# EAGLE schematic XBee3 (EAGLE 7.4.0)
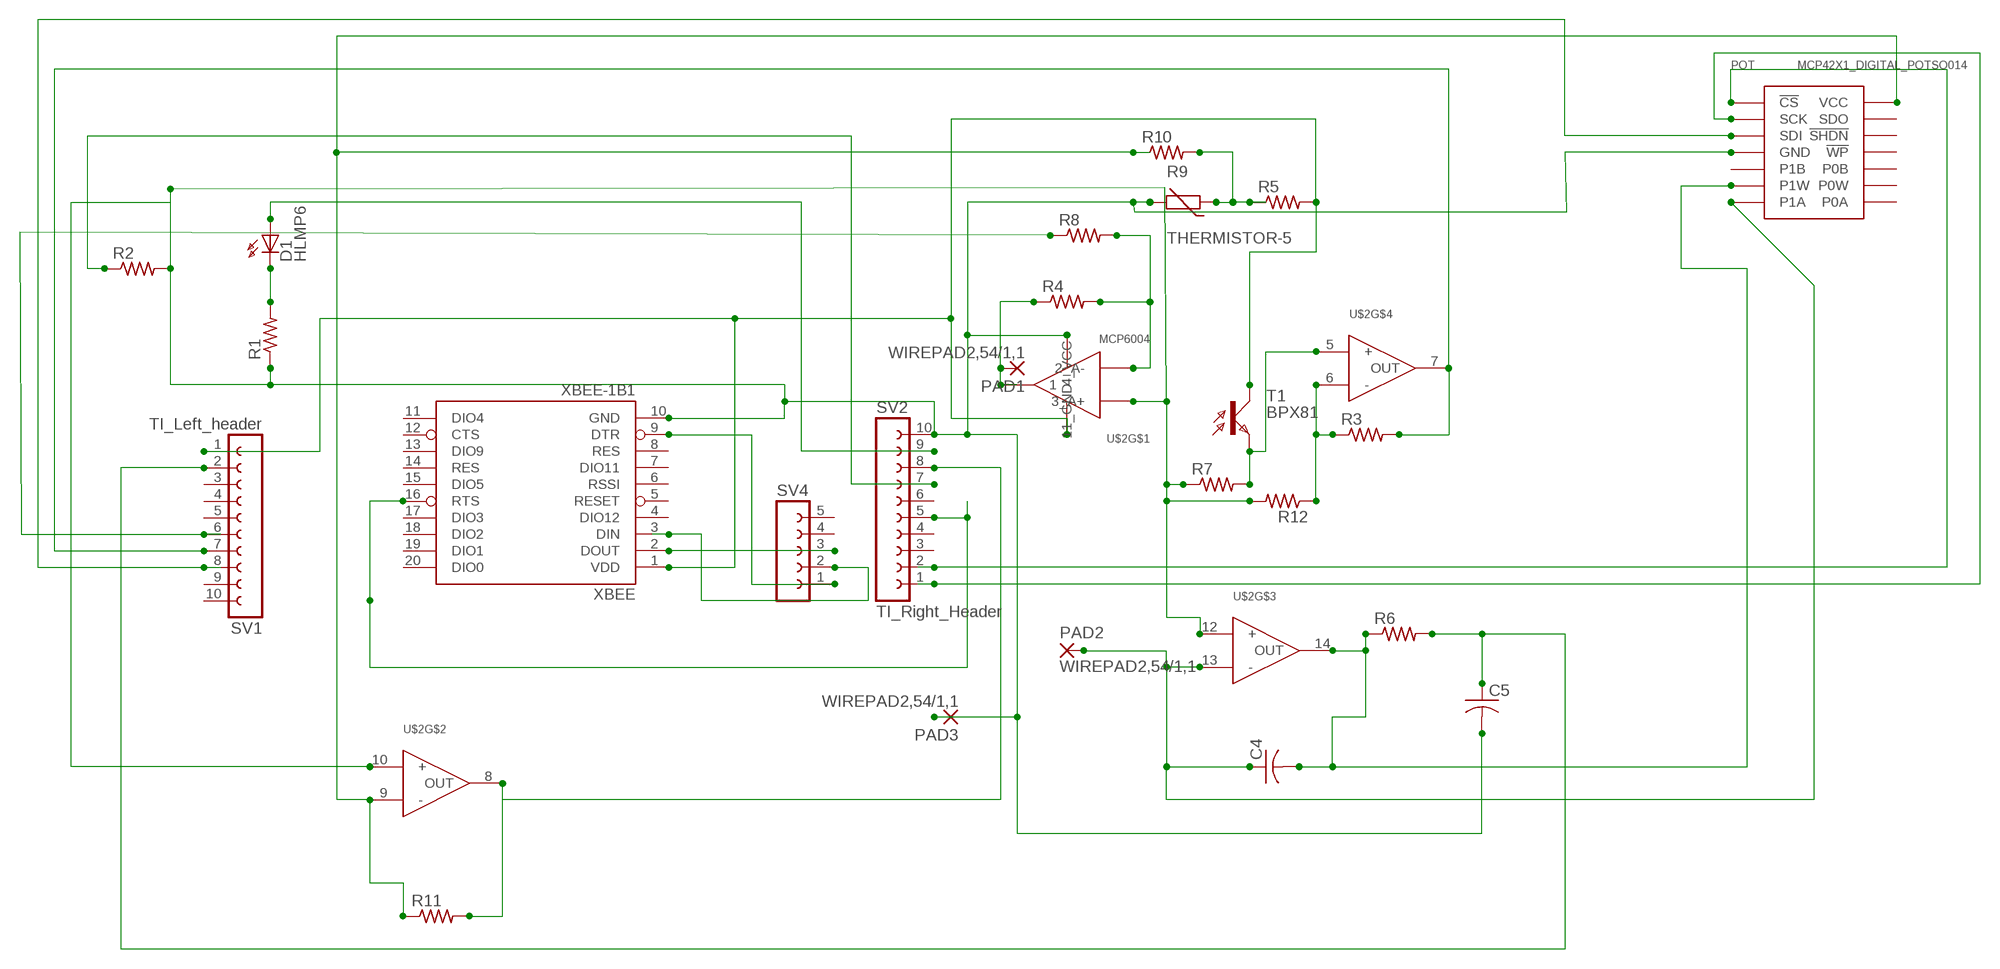
[diagram p0: schematic, sheet 1]

## Parts
C4  C-USC0603  [C0603]
C5  C-USC0603  [C0603]
D1  HLMP6  [HLMP6]
PAD1  WIREPAD2,54/1,1  [2,54/1,1]
PAD2  WIREPAD2,54/1,1  [2,54/1,1]
PAD3  WIREPAD2,54/1,1  [2,54/1,1]
POT  MCP42X1_DIGITAL_POTSO014  [SO014]
R1  R-US_R0603  [R0603]
R2  R-US_R0603  [R0603]
R3  R-US_R0603  [R0603]
R4  R-US_R0603  [R0603]
R5  R-US_R0603  [R0603]
R6  R-US_R0603  [R0603]
R7  R-US_R0603  [R0603]
R8  R-US_R0603  [R0603]
R9  THERMISTOR-5  [R-5]
R10  R-US_R0603  [R0603]
R11  R-US_R0603  [R0603]
R12  R-US_R0603  [R0603]
SV1  TI_Left_header  FE10-1  [FE10]
SV2  TI_Right_Header  FE10-1  [FE10]
SV4  FE05-1  [FE05-1]
T1  BPX81  [BPX81]
U$2  MCP6004  [SO014]
XBEE  XBEE-1B1  [XBEE-1]

## Nets
GND: C5.2 PAD3.1(P) POT.P4(GND) R1.1 R2.2 R7.1 R9.2 R12.2 SV2.10 U$2.3(3_A+) U$2.10(+) U$2.11(11_GND) U$2.12(+) XBEE.10(GND)
N$1: D1.K R1.2
N$2: R7.2 T1.E U$2.5(+)
N$3: SV4.3 XBEE.2(DOUT)
N$4: SV4.1 XBEE.9(DTR)
N$5: SV4.2 XBEE.3(DIN)
N$6: R3.1 R12.1 U$2.6(-)
N$11: R2.1 SV2.7
N$12: R11.2 SV2.8 U$2.8(OUT)
N$13: POT.P14(VCC) R10.1 R11.1 U$2.9(-)
N$14: PAD1.1(P) R4.1 U$2.1
N$15: D1.A SV2.9
N$17: C4.1 PAD2.1(P) POT.P7(P1A) U$2.13(-)
N$18: C4.2 POT.P6(P1W) R6.1 U$2.14(OUT)
N$19: C5.1 R6.2 SV1.2
N$20: R5.1 R9.1 R10.2
N$21: R4.2 R8.2 U$2.2(2_A-)
N$22: SV2.5 XBEE.16(RTS)
POT_CS: POT.P1(!CS) SV2.2
POT_SCK: POT.P2(SCK) SV2.1
POT_SDI: POT.P3(SDI) SV1.8
PULSE: R8.1 SV1.6
TI_PN7_READ: R3.2 SV1.7 U$2.7(OUT)
VCC: R5.2 SV1.1 T1.C U$2.4(4_VCC) XBEE.1(VDD)
Unconnected: POT.P5(P1B) POT.P8(P0A) POT.P9(P0W) POT.P10(P0B) POT.P11(!WP) POT.P12(!SHDN) POT.P13(SDO) SV1.3 SV1.4 SV1.5 SV1.9 SV1.10 SV2.3 SV2.4 SV2.6 SV4.4 SV4.5 XBEE.4(DIO12) XBEE.5(RESET) XBEE.6(RSSI) XBEE.7(DIO11) XBEE.8(RES) XBEE.11(DIO4) XBEE.12(CTS) XBEE.13(DIO9) XBEE.14(RES) XBEE.15(DIO5) XBEE.17(DIO3) XBEE.18(DIO2) XBEE.19(DIO1) XBEE.20(DIO0)

## Library data of the parts
C4 C5 = rcl:C-US: CAPACITOR, American symbol
D1 = display-hp:HLMP6: LED 2mm horizontal; MF: AGILENT TECHNOLOGIES; MPN: HLMP-6500; OC_FARNELL: 1652490; OC_NEWARK: 40K0088
PAD1-PAD3 = wirepad:WIREPAD: Wire PAD connect wire on PCB
POT = JackLibrary:MCP42X1_DIGITAL_POT
R1-R8 R10-R12 = resistor:R-US_: RESISTOR, American symbol
R9 = varistor:THERMISTOR: THERMISTOR
SV1 SV2 = con-lsta:FE10-1: FEMALE HEADER; OC_FARNELL: unknown; OC_NEWARK: unknown
SV4 = con-lsta:FE05-1: FEMALE HEADER; OC_FARNELL: unknown; OC_NEWARK: unknown
T1 = opto-trans-siemens:BPX81: PHOTO TRANSISTOR; OC_FARNELL: unknown; OC_NEWARK: unknown
U$2 = SparkFun-AnalogIC:MCP6004: 14SOIC quad op amp, R2R, low power
XBEE = SparkFun-RF:XBEE-1: Xbee module footprints SMT header is CONN-09042.